# EAGLE design PICKIT4-adaptorISP (EAGLE 7.7.0)
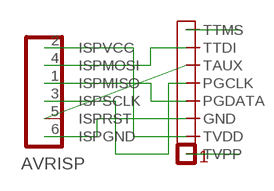
[diagram p0: schematic, sheet 1]

## Parts
AVRISP  AVR-ISP  [6PINS]
U$1  PICKIT4PINHDR  [PINHEAD1X8]

## Nets
GND [power]: AVRISP.6(ISPGND) U$1.P$3(GND)
MISO [clock]: AVRISP.1(ISPMISO) U$1.P$4(PGDATA)
MOSI [clock]: AVRISP.4(ISPMOSI) U$1.P$7(TTDI)
SCK [clock]: AVRISP.3(ISPSCLK) U$1.P$5(PGCLK)
TAUX: AVRISP.5(ISPRST) U$1.P$6(TAUX)
TTMS: U$1.P$8(TTMS)
TVDD [power]: AVRISP.2(ISPVCC) U$1.P$2(TVDD)
TVPP: U$1.P$1(TVPP)

## Library data of the parts
AVRISP = Arduino-shield-scaffolds:AVR-ISP: AVR SPI ISP programming connector (6pins)
U$1 = mylib4:PICKIT4: PICKIT 4 Programming connector Handles PICx, ARM SWD, AVR ISP, UPDI, PDI, TPI, an JTAG/EJTAG

## Net classes
0 default: width 0.4 mm, drill 0.6 mm, clearance 0.152 mm
1 power: width 0.8 mm, drill 0.7 mm, clearance 0.152 mm
2 clock: width 0.25 mm, drill 0.6 mm, clearance 0.152 mm

## Board
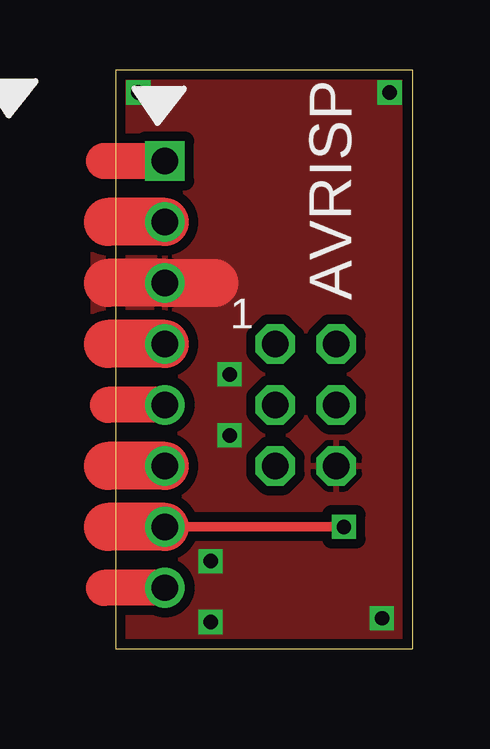
[diagram p1: board, top side]
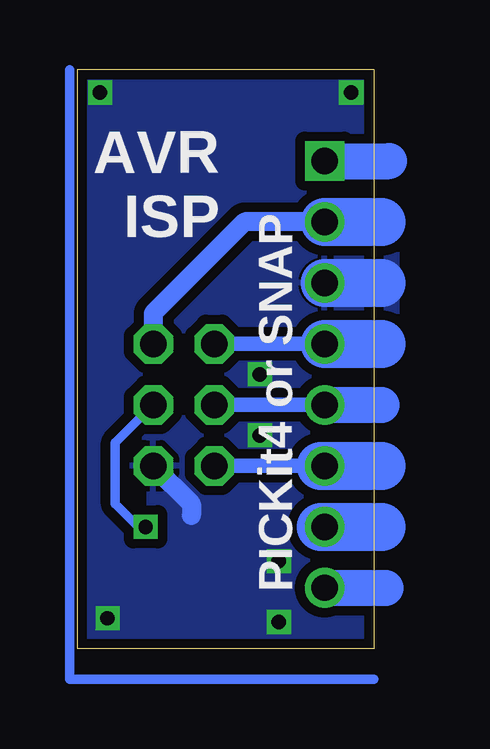
[diagram p2: board, bottom side, seen from below]

Size 12.38 x 24.13 mm. Coordinates in mm from the lower left corner, seen from the top.
Outline: 0,0 12.38,0 12.38,24.13 0,24.13 0,0
Copper layers (1*16): Top 0.035mm / dielectric 1.5mm / Bottom 0.035mm
Design rules "default *": minimum track width 10mil, minimum drill 24mil, track to track 6mil, track to pad 6mil, pad to pad 8mil, via to via 8mil, smd to smd 8mil, copper to edge 16mil, drill to drill 8mil, minimum pad ring 10mil, minimum via ring 8mil, stop-mask expansion 4mil, vias tented up to drill 0.65mm, thermal gap 10mil
bRestrict: 1 lines

### Footprints (pad centres in the part's own frame; a part is rotated, then mirrored left to right if it is on the bottom)
6PINS = drill 1.1 octagon: 1 -1.27,2.54; 2 1.27,2.54; 3 -1.27,0; 4 1.27,0; 5 -1.27,-2.54; 6 1.27,-2.54
PINHEAD1X8 = drill 1.1 square: P$1 0,8.89 | drill 1.1: P$2 0,6.35; P$3 0,3.81; P$4 0,1.27; P$5 0,-1.27; P$6 0,-3.81; P$7 0,-6.35; P$8 0,-8.89

### Placement (x,y rotation side)
AVRISP  7.94,10.16 0 top
U$1  2.06,11.43 0 top

### Tracks (layer width: path | path; a pad name or v marks a point on that pad's centre or on a via)
GND  (via drill 0.6)
  Top 2: -0.32,15.24 U$1.P$3 4.13,15.24
  Bottom 0.4: AVRISP.6 7.62,5.71
  Bottom 0.8: AVRISP.6 7.62,6.03 7.62,5.56
  Bottom 2: U$1.P$3 -0.32,15.24
  other vias: 0.95,23.18 11.43,23.18 11.11,1.27 4.76,8.89 4.76,11.43 3.97,1.11 3.97,3.65
  pour Top (isolate 0.4): -0.95,24.77 -0.95,-2.22 13.02,-2.22 13.02,24.77
  pour Bottom (isolate 0.4): -0.95,25.16 -0.95,-1.91 12.78,-1.98 12.78,25.32
MISO
  Top 2: U$1.P$4 -0.32,12.7
  Bottom 0.6: U$1.P$4 AVRISP.1
  Bottom 2: U$1.P$4 -0.32,12.7
MOSI  (via drill 0.6)
  Top 0.4: v9.53,5.08 U$1.P$7
  Top 2: U$1.P$7 -0.32,5.08
  Bottom 0.4: U$1.P$7 2.22,5.08 | v9.53,5.08 9.84,5.08 10.79,6.03 10.79,8.57 AVRISP.4
  Bottom 2: 2.22,5.08 -0.32,5.08
N$1
  Bottom 0.4: 0,-1.27 12.7,-1.27 12.7,24.13
SCK
  Top 1.5: U$1.P$5 -0.32,10.16
  Bottom 0.6: U$1.P$5 AVRISP.3
  Bottom 1.5: U$1.P$5 -0.32,10.16
TAUX
  Top 2: U$1.P$6 -0.32,7.62
  Bottom 0.6: 2.22,7.62 AVRISP.5
  Bottom 0.8: U$1.P$6 2.22,7.62
  Bottom 2: 2.22,7.62 -0.32,7.62
TTMS
  Top 1.5: U$1.P$8 -0.48,2.54
  Bottom 1.5: U$1.P$8 -0.48,2.54
TVDD
  Top 2: U$1.P$2 -0.32,17.78
  Bottom 0.8: U$1.P$2 5.4,17.78 9.21,13.97 AVRISP.2
  Bottom 2: U$1.P$2 -0.32,17.78
TVPP
  Top 1.5: U$1.P$1 -0.48,20.32
  Bottom 1.5: U$1.P$1 -0.64,20.32

### Text on the board
_tSilk: AVR / ISP | 1 | PICKit4/SNAP
_bplace: AVR / ISP | PICKit4 or SNAP